# Altium project Traning_Deslab.PrjPcb
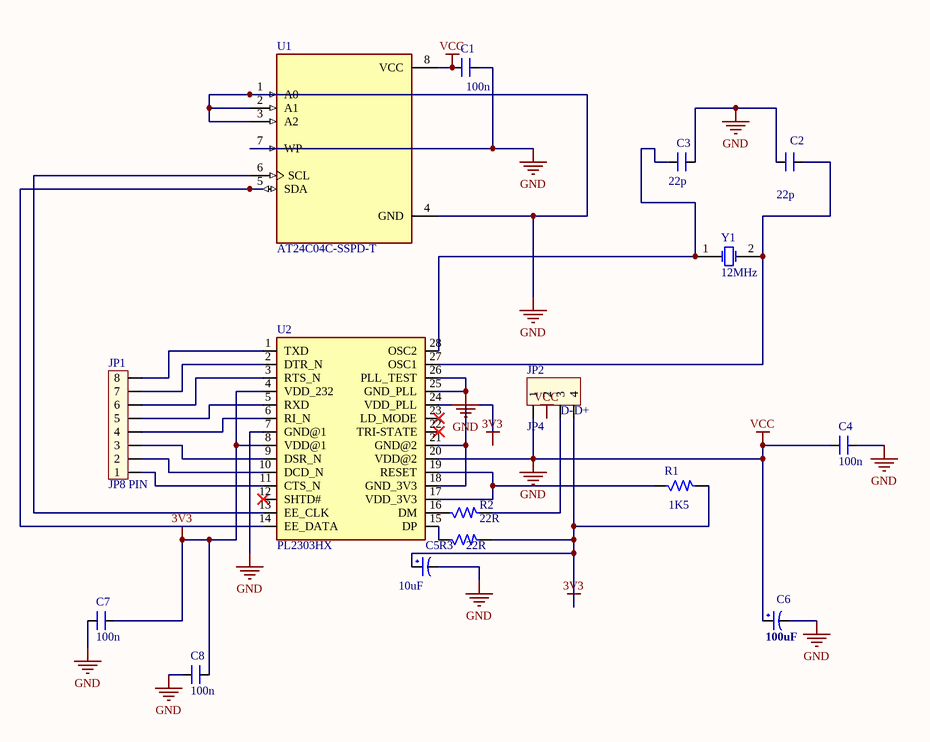
[diagram p0: L1S2.SchDoc]
1 sheet, 16 parts. Net scope: global (net labels, ports and power ports of the same name join across sheets).
Board file: L1S2.PcbDoc

## Sheet L1S2.SchDoc
size A4; SheetNumber: 1; SheetTotal: 1

### Parts
C1  100n  [0805_Cap]
C2  22p  [0805_Cap]
C3  22p  [0805_Cap]
C4  100n  [0805_Cap]
C5  10uF  [CP1/2.5]
C6  100uF  [CP1/2.5]
C7  100n  [0805_Cap]
C8  100n  [0805_Cap]
JP1  JP8 PIN  [JP8]
JP2  JP4  [CON4]
R1  1K5  [0402_res]
R2  22R  [0402_res]
R3  22R  [0402_res]
U1  AT24C04C-SSPD-T  [SOIC127P600X175-8N]
U2  PL2303HX  [TSSOP28]
Y1  12MHz  [XT2]

### Nets
3V3: C5.1 C7.2 C8.2 JP2.4 R1.2 R3.2 U2.4(VDD_232) U2.8(VDD@1) U2.24(VDD_PLL)
GND: C1.1 C1.2 C2.1 C3.2 C4.1 C4.2 C5.2 C6.1 C6.2 C7.1 C8.1 JP2.1 JP2.2 U1.1(A0) U1.2(A1) U1.3(A2) U1.4(GND) U1.7(WP) U1.8(VCC) U2.7(GND@1) U2.18(GND_3V3) U2.20(VDD@2) U2.21(GND@2) U2.25(GND_PLL) U2.26(PLL_TEST)  [also labelled VCC]
NetC2_2: C2.2 U2.27(OSC1) Y1.2(OSC2)
NetC3_1: C3.1 U2.28(OSC2) Y1.1(OSC1)
NetJP1_1: JP1.1 U2.11(CTS_N)
NetJP1_2: JP1.2 U2.10(DCD_N)
NetJP1_3: JP1.3 U2.9(DSR_N)
NetJP1_4: JP1.4 U2.6(RI_N)
NetJP1_5: JP1.5 U2.5(RXD)
NetJP1_6: JP1.6 U2.3(RTS_N)
NetJP1_7: JP1.7 U2.2(DTR_N)
NetJP1_8: JP1.8 U2.1(TXD)
NetJP2_3: JP2.3 R2.2
NetR1_1: R1.1 U2.17(VDD_3V3) U2.19(RESET)
NetR2_1: R2.1 U2.16(DM)
NetR3_1: R3.1 U2.15(DP)
NetU1_5: U1.5(SDA) U2.14(EE_DATA)
NetU1_6: U1.6(SCL) U2.13(EE_CLK)

Not connected (* = marked no-connect by the designer): U2 12(SHTD#)* 22(TRI-STATE)* 23(LD_MODE)*

### Notes on the sheet
- (near JP2) D-
- (near JP2) D+

### Library data of the parts
C1-C4 C7 C8 = CM: Cap SMD; Value: 103; Manufacture: *; Part Number: *; Unit Price: *
C5 C6 = CP2: C 47uF/50V , 220uF/16V; Value: 47uF/16 - 50V; Description 1: 470uF/6,3V - 330uF/10V - 220uF/16V; Description 2: 100uF/25V - 35V - 47uF/50V - 22uF/100V; Description 3: 33uF => 47uF/63V - 1uF => 4,7uF/160V; Description 4: 1uF => 2,2uF/250V - 1uF/350V
JP1 = JP8: Value: JP7
JP2 = Con4: Connector 4; Value: Connector 4
R1-R3 = R: Resistor 1/4W; Value: R1/4W - 1K; Manufacture: *; Part Number: *; Unit Price: *
U1 = AT24C04C-SSPD-T: EEPROM Memory IC 4Kb _512 x 8_ IÂ²C 400kHz 900ns 8-SOIC; MF: Microchip Technology; Value: *; SnapEDA_Link: https://www.snapeda.com/parts/AT24C04C-SSPD-T/Microchip/view-part/3611049/?ref=snap; Availability: Unavailable; MP: AT24C04C-SSPD-T; Package: SOIC-8 Microchip Technology; Price: None
U2 = PL2303HX: USB to RS232 TSSOP28; MF: Prolific Technology; MP: PL-2303HX; SnapEDA_Link: https://www.snapeda.com/parts/PL-2303HX/Prolific%20Technology/view-part/598561/?ref=snap; Availability: Unavailable; Value: *; Package: None; Price: None
Y1 = XTAL: Crystal Oscillator; Published: 8-Jun-2000; LatestRevisionDate: 17-Jul-2002; LatestRevisionNote: Re-released for DXP Platform.; PackageReference: R38; Publisher: Altium Limited; PackageDescription: Crystal, Thru-Hole; 2 Leads; Body 3.1 x 8.2 mm (Dia.xH)